# Altium schematic sheet Schematic.SchDoc
size A
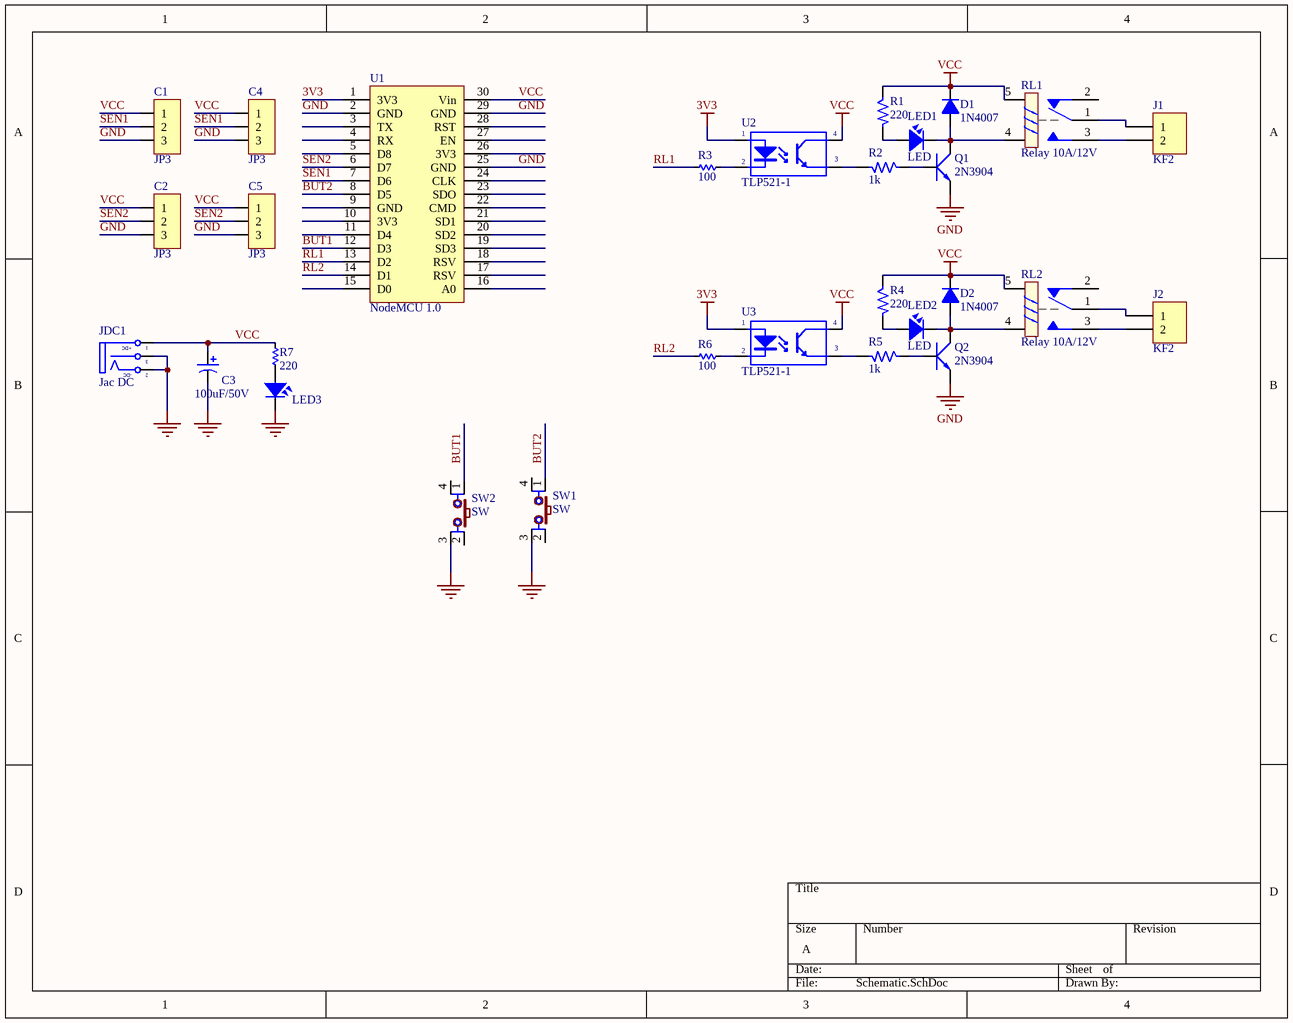
[diagram p0: Schematic.SchDoc]

## Parts
C1  JP3  [JP3-C1T]
C2  JP3  [JP3-C1T]
C3  value 100uF/50V  [CE_8x12]  (hidden comment: CP3)
C4  JP3  [JP3-D1T]
C5  JP3  [JP3-D1T]
D1  1N4007  [DIO-1A-SMALL]
D2  1N4007  [DIO-1A-SMALL]
J1  KF2  [KF2-5.08]
J2  KF2  [KF2-5.08]
JDC1  Jac DC  [DC0]
LED1  LED  [LED-3MM-RED]
LED2  LED  [LED-3MM-RED]
LED3  LED  [LED-3MM-RED]  (value not drawn)
Q1  2N3904  [TO92-123]
Q2  2N3904  [TO92-123]
R1  220  [RES-1/4W-SMALL]
R2  1k  [RES-1/4W-SMALL]
R3  100  [RES-1/4W-SMALL]
R4  220  [RES-1/4W-SMALL]
R5  1k  [RES-1/4W-SMALL]
R6  100  [RES-1/4W-SMALL]
R7  220  [RES-1/4W-SMALL]
RL1  Relay 10A/12V  [RELAY 5]
RL2  Relay 10A/12V  [RELAY 5]
SW1  SW  [SW4-12x12x8]
SW2  SW  [SW4-12x12x8]
U1  NodeMCU 1.0  [NODEMCU-1.0]
U2  TLP521-1  [DIP4]
U3  TLP521-1  [DIP4]

## Nets
3V3: U1.1(3V3) U2.1(A) U3.1(A)
GND: C1.3 C2.3 C3.2 C4.3 C5.3 JDC1.2(TN) JDC1.3(S) LED3.2 Q1.1(E) Q2.1(E) SW1.3 SW2.3 U1.2(GND) U1.25(GND) U1.29(GND)
VCC: C1.1 C2.1 C3.1 C4.1 C5.1 D1.2(K) D2.2(K) JDC1.1(T) R1.1 R4.1 R7.1 RL1.5 RL2.5 U1.30(Vin) U2.4(C) U3.4(C)
BUT1: SW2.1 U1.12(D3)
BUT2: SW1.1 U1.8(D5)
RL1: R3.2 U1.13(D2)
RL2: R6.2 U1.14(D1)
SEN1: C1.2 C4.2 U1.7(D6)
SEN2: C2.2 C5.2 U1.6(D7)
NetD1_1: D1.1(A) LED1.2 Q1.3(C) RL1.4
NetD2_1: D2.1(A) LED2.2 Q2.3(C) RL2.4
NetJ1_1: J1.1 RL1.1
NetJ1_2: J1.2 RL1.3
NetJ2_1: J2.1 RL2.1
NetJ2_2: J2.2 RL2.3
NetLED1_1: LED1.1 R1.2
NetLED2_1: LED2.1 R4.2
NetLED3_1: LED3.1 R7.2
NetQ1_2: Q1.2(B) R2.1
NetQ2_2: Q2.2(B) R5.1
NetR2_2: R2.2 U2.3(E)
NetR3_1: R3.1 U2.2(K)
NetR5_2: R5.2 U3.3(E)
NetR6_1: R6.1 U3.2(K)

Not connected (* = marked no-connect by the designer): RL1 2; RL2 2; SW1 2 4; SW2 2 4; U1 3(TX) 4(RX) 5(D8) 9(GND) 10(3V3) 11(D4) 15(D0) 16(A0) 17(RSV) 18(RSV) 19(SD3) 20(SD2) 21(SD1) 22(CMD) 23(SDO) 24(CLK) 26(3V3) 27(EN) 28(RST)

## Notes on the sheet
- (in symbol DCIN) +DC; -DC

## Library data of the parts
C1 C2 C4 C5 = JP3: WR-PHD 2.54 mm Angled Socket Header; Manufacturer: W¨¹rth Elektronik eiSos GmbH; partNo: 613003143121; ComponentLink1 Description: Manufacturer; ComponentLink2 Description: Datasheet; NoPins: 03; Created Date: 29 March 2013; ComponentLink1URL: http://www.we-online.com; ComponentLink2URL: http://katalog.we-online.de/em/datasheet/6130xx143121.pdf; Created by: Karrer Zheng
C3 = CP3: Cap P  470uF/16V - 100uF?35V; Description 1: 1000uF/6,3V - 470uF/16V - 330uF - 25V; Description 2: 220uF/35V - 100uF/50V - 63V - 4,7uF/200V; Description 3: 22uF => 33uF100V - 3,3uF => 4,7uF/250V; Description 4: 2,2uF =>3,3uF/350 - 2,2uF/400V - 1uF/450V
D1 D2 = D1A: Diode 1A; Value: 1N4007
J1 J2 = KF2: Manufacturer: Würth Elektronik eiSos GmbH; partNo: 691103110002; ComponentLink1 Description: Manufacturer; ComponentLink2 Description: Datasheet; NoPins: 2; Created Date: 29 October 2013; ComponentLink1URL: http://www.we-online.com; ComponentLink2URL: http://katalog.we-online.de/em/datasheet/6911031100xx.pdf; Created by: Karrer Zheng
JDC1 = DCIN: Jac DC input; Value: Jac DC
LED1 LED2 = LED: LED Single colour Green and Red; Value: LED 3 ly Single Colour
LED3 = LED SMD: Value: LED 3 - 5 ly 2 Colour
Q1 Q2 = 2N904: NPN 600mW, ECB; Value: C1815
R1 R2 R4 R5 = R: Resistor 1/4W; Value: R1/4W - 1K
R3 R6 R7 = Res-SMD: Resistor; Manufacturer: Generic Components; Class: Passive; Published: 08/06/2000; Publisher: Altium Hobart Technology Centre
RL1 RL2 = Relay 5: Relay SPDT,10A - 12VDC 5 Pin; Value: Relay SPDT, 10A, 12V
SW1 SW2 = SW4: Switch button 4 pin; Value: Button chip 4 pin
U2 U3 = TLP521-1: Single Opto; Value: TLP5211